# EAGLE design breakout (EAGLE 7.5.0)
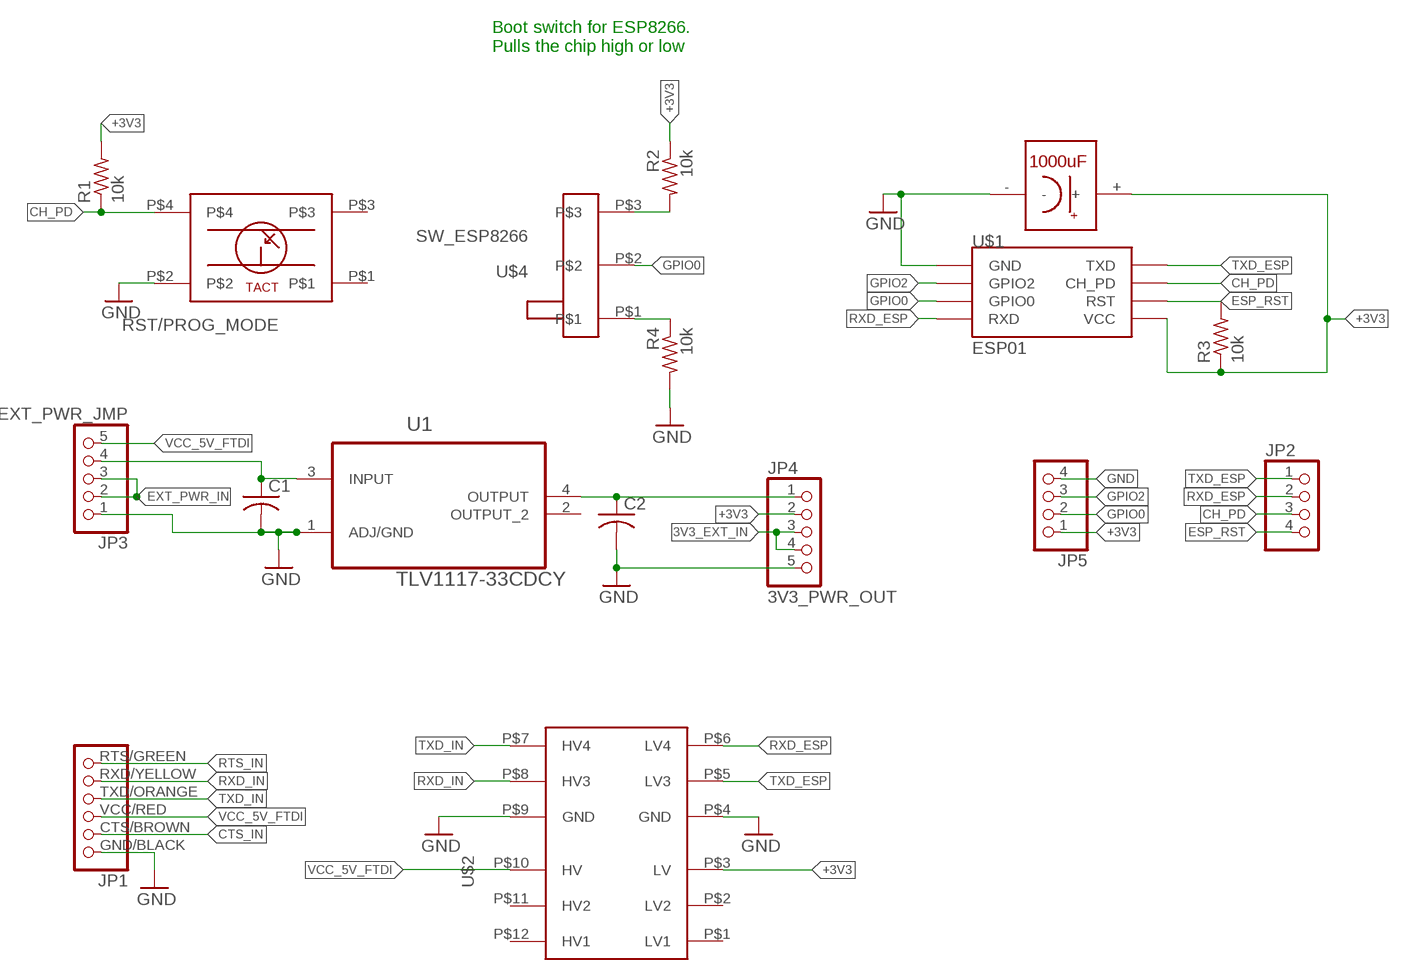
[diagram p0: schematic, sheet 1]

## Parts
C1  C-USC0805K  [C0805K]
C2  C-USC0805K  [C0805K]
JP1  FTDI_CABLE  [FTDI_5V_SPARKFUN]
JP2  PINHD-1X4  [1X04]
JP3  EXT_PWR_JMP  PINHD-1X5  [1X05]
JP4  3V3_PWR_OUT  PINHD-1X5  [1X05]
JP5  PINHD-1X4  [1X04]
R1  10k  R-US_R1206  [R1206]
R2  10k  R-US_R1206  [R1206]
R3  10k  R-US_R1206  [R1206]
R4  10k  R-US_R1206  [R1206]
RST/PROG_MODE  TACT_SWITCH  [TACT]
U1  TLV1117-33CDCY  [SOT230P700X180-4N]
U$1  ESP01  [ESP01]
U$2  LVLSHIFTER  [LVLSFT_PAC]
U$3  TZVCAP  [TZV1000M]
U$4  SW_ESP8266  [SW_PCB_ESP]

## Nets
3V3_EXT_IN: JP4.3 JP4.4
+3V3: JP4.2 JP5.1 R1.2 R2.1 R3.1 U$1.VCC U$2.P$3(LV) U$3.+
CH_PD: JP2.3 R1.1 RST/PROG_MODE.P$4 U$1.CH_PD
CTS_IN: JP1.CTS/BROWN
ESP_RST: JP2.4 R3.2 U$1.RST
EXT_PWR_IN: JP3.2 JP3.3
GND: C1.2 C2.2 JP1.GND/BLACK JP3.1 JP4.5 JP5.4 R4.2 RST/PROG_MODE.P$2 U1.1(ADJ/GND) U$1.GND U$2.P$4(GND) U$2.P$9(GND) U$3.-
GPIO0: JP5.2 U$1.GPIO0 U$4.P$2
GPIO2: JP5.3 U$1.GPIO2
N$1: C2.1 JP4.1 U1.4(OUTPUT)
N$2: C1.1 JP3.4 U1.3(INPUT)
N$4: R2.2 U$4.P$3
N$6: R4.1 U$4.P$1
RTS_IN: JP1.RTS/GREEN
RXD_ESP: JP2.2 U$1.RX(RXD) U$2.P$6(LV4)
RXD_IN: JP1.RXD/YELLOW U$2.P$8(HV3)
TXD_ESP: JP2.1 U$1.TX(TXD) U$2.P$5(LV3)
TXD_IN: JP1.TXD/ORANGE U$2.P$7(HV4)
VCC_5V_FTDI: JP1.VCC/RED JP3.5 U$2.P$10(HV)
Unconnected: RST/PROG_MODE.P$1 RST/PROG_MODE.P$3 U1.2(OUTPUT_2) U$2.P$1(LV1) U$2.P$2(LV2) U$2.P$11(HV2) U$2.P$12(HV1)

## Notes on the sheet
- Boot switch for ESP8266. 
  Pulls the chip high or low

## Library data of the parts
C1 C2 = rcl:C-US: CAPACITOR, American symbol
JP1 = mqp_custom_parts:FTDI_CABLE: PIN HEADER
JP2 JP5 = pinhead:PINHD-1X4: PIN HEADER
JP3 JP4 = pinhead:PINHD-1X5: PIN HEADER
R1-R4 = resistor:R-US_: RESISTOR, American symbol
RST/PROG_MODE = mqp_custom_parts:TACT_SWITCH
U1 = Texas Instruments_By_element14_Batch_1:TLV1117-33CDCY: V REG, LDO, 3.3V, 0.8A; MPN: TLV1117-33CDCY; OC_FARNELL: 1494942; OC_NEWARK: 67K8520; PACKAGE: SOT-223-3; SUPPLIER: TEXAS INSTRUMENTS
U$1 = mqp_custom_parts:ESP01: ESP8266 Wifi module 01
U$2 = mqp_custom_parts:LVLSHIFTER
U$3 = mqp_custom_parts:TZVCAP
U$4 = mqp_custom_parts:SW_ESP8266

## Board
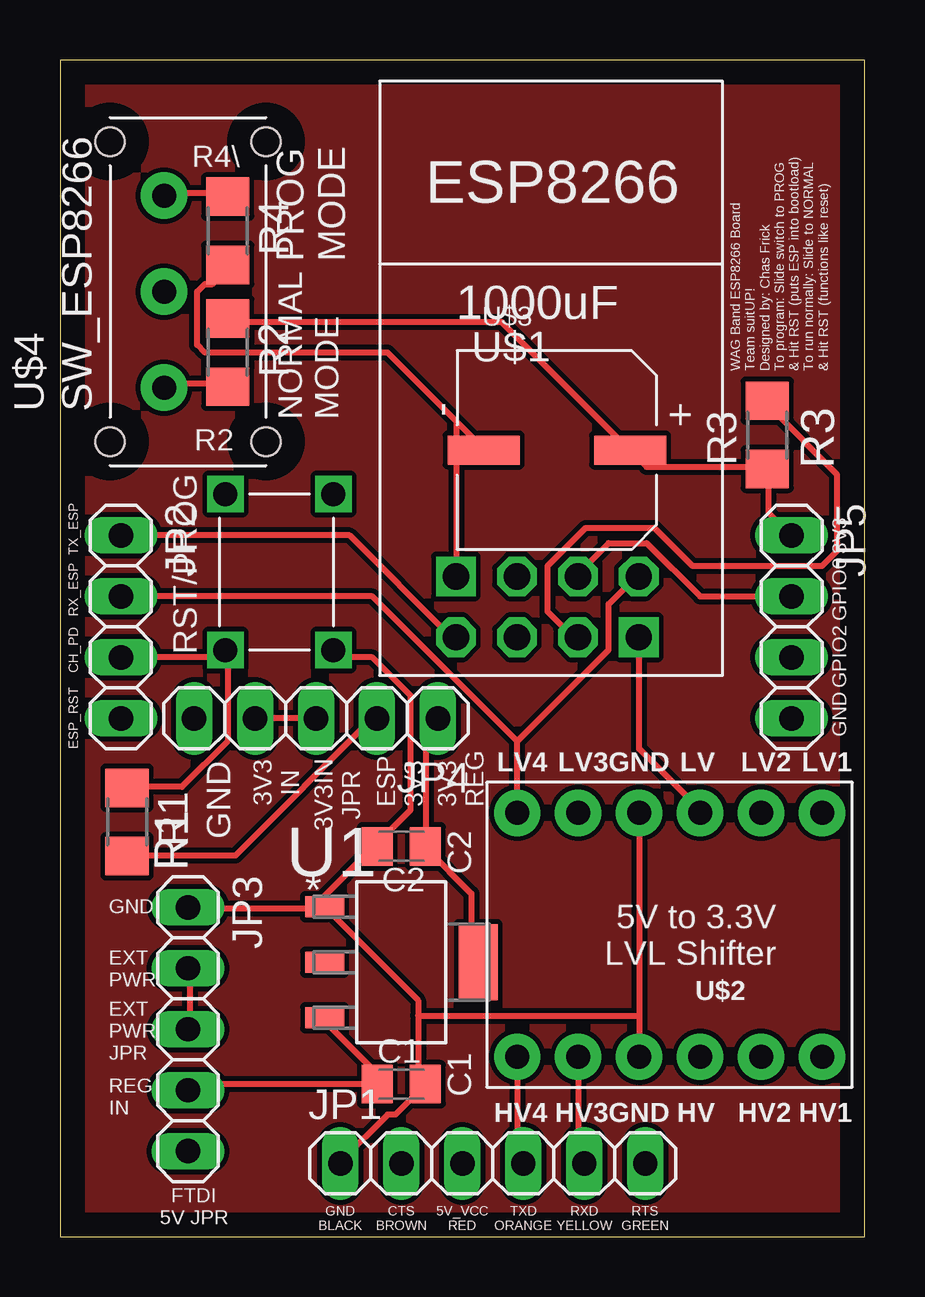
[diagram p1: board, top side]
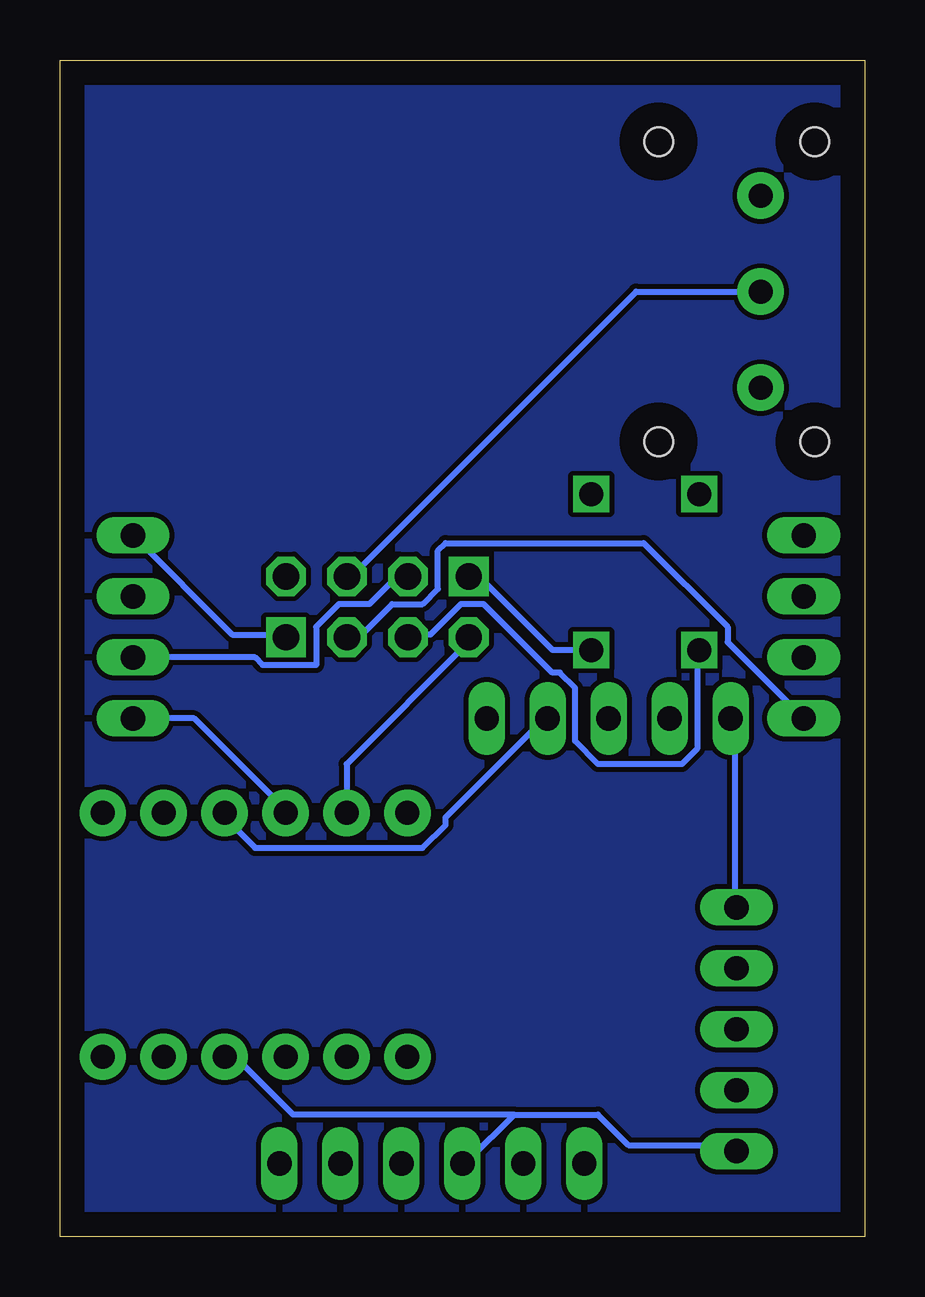
[diagram p2: board, bottom side, seen from below]

Size 33.53 x 49.02 mm. Coordinates in mm from the lower left corner, seen from the top.
Outline: 0,0 33.53,0 33.53,49.02 0,49.02 0,0
Copper layers (1*16): Top 0.035mm / dielectric 1.5mm / Bottom 0.035mm
Design rules "default": minimum track width 10mil, minimum drill 24mil, track to track 8mil, track to pad 8mil, pad to pad 8mil, via to via 8mil, smd to smd 8mil, copper to edge 40mil, drill to drill 8mil, minimum pad ring 10mil, minimum via ring 8mil, stop-mask expansion 4mil, vias tented up to drill 0mil, thermal gap 10mil

### Footprints (pad centres in the part's own frame; a part is rotated, then mirrored left to right if it is on the bottom)
C0805K = smd 1.3 x 1.6: 1 -1,0; 2 1,0
FTDI_5V_SPARKFUN = drill 1.016 long: CTS/BROWN -3.81,0; GND/BLACK -6.35,0; RTS/GREEN 6.35,0; RXD/YELLOW 3.81,0; TXD/ORANGE 1.27,0; VCC/RED -1.27,0
1X04 = drill 1.016 long: 1 -3.81,0; 2 -1.27,0; 3 1.27,0; 4 3.81,0
1X05 = drill 1.016 long: 1 -5.08,0; 2 -2.54,0; 3 0,0; 4 2.54,0; 5 5.08,0
R1206 = smd 1.6 x 1.803: 1 -1.422,0; 2 1.422,0
TACT = drill 1 square: P$1 -3.25,2.25; P$2 3.25,2.25; P$3 -3.25,-2.25; P$4 3.25,-2.25
SOT230P700X180-4N = smd 1.626 x 0.889: 1 -3.2,2.311; 2 -3.2,0; 3 -3.2,-2.311 | smd 1.626 x 3.175: 4 3.2,0
ESP01 = drill 1.1 octagon: CH_PD -1.285,-8.178; GPIO0 1.255,-5.638; GPIO2 -1.285,-5.638; RST 1.255,-8.178; RX 3.795,-5.638; TX -3.825,-8.178 | drill 1.1 square: GND -3.825,-5.638; VCC 3.795,-8.178
LVLSFT_PAC = drill 1 pad 1.93: P$1 -6.35,-5.08; P$2 -3.81,-5.08; P$3 -1.27,-5.08; P$4 1.27,-5.08; P$5 3.81,-5.08; P$6 6.35,-5.08; P$7 6.35,5.08; P$8 3.81,5.08; P$9 1.27,5.08; P$10 -1.27,5.08; P$11 -3.81,5.08; P$12 -6.35,5.08
TZV1000M = smd 1.2 x 3: + 0,3.05; - 0,-3.05
SW_PCB_ESP = drill 1 pad 1.93: P$1 4,1; P$2 0,1; P$3 -4,1 | hole 1.2: -6.25,3.25; -6.25,-3.25; 6.25,-3.25; 6.25,3.25

### Placement (x,y rotation side)
C1  14.22,6.35 0 top
C2  14.22,16.26 180 top
JP1  18.03,3.05 0 top
JP2  2.54,25.4 270 top
JP3  5.33,8.64 270 top
JP4  10.67,21.59 180 top
JP5  30.48,25.4 270 top
R1  2.79,17.27 270 top
R2  6.99,36.83 270 top
R3  29.46,33.4 90 top
R4  6.99,41.91 270 top
RST/PROG_MODE  9.14,27.69 270 top
U1  14.22,11.43 0 top
U$1  20.32,33.15 0 top
U$2  25.4,12.57 180 top
U$3  20.7,32.77 270 top
U$4  5.33,39.37 90 top

### Tracks (layer width: path | path; a pad name or v marks a point on that pad's centre or on a via)
3V3_EXT_IN
  Top 0.254: JP4.3 JP4.4
+3V3
  Top 0.254: R1.2 2.86,15.88 7.3,15.88 13.02,21.59 JP4.2 | U$1.VCC 24.13,24.77 24.13,20.32 26.67,17.78 U$2.P$3 | JP5.1 29.53,30.16 29.53,31.75 R3.1 29.21,32.07 24.45,32.07 23.81,32.7 U$3.+ 23.5,33.02 18.41,38.1 6.99,38.1 R2.1
  Bottom 0.254: JP5.1 26.35,25.08 24.13,25.08 U$1.VCC | JP4.2 13.34,21.59 17.46,17.46 17.46,17.14 18.41,16.19 25.4,16.19 26.67,17.46 U$2.P$3
CH_PD
  Top 0.254: R1.1 2.86,18.73 5.08,18.73 6.99,20.64 6.99,24.13 RST/PROG_MODE.P$4 6.67,24.13 JP2.3
  Bottom 0.254: U$1.CH_PD 18.73,25.08 18.1,25.08 16.83,26.35 15.88,26.35 13.02,23.5 12.7,23.5 12.06,22.86 12.06,20.64 11.11,19.68 7.62,19.68 6.99,20.32 6.99,24.13 RST/PROG_MODE.P$4
ESP_RST
  Top 0.254: R3.2 29.53,34.61 32.38,31.75 32.38,28.57 31.75,27.94 26.35,27.94 24.77,29.53 21.91,29.53 20.32,27.94 20.32,26.04 21.27,25.08 U$1.RST
  Bottom 0.254: JP2.4 5.71,24.77 5.71,25.4 9.21,28.89 17.46,28.89 17.78,28.57 17.78,26.99 18.41,26.35 19.68,26.35 21.27,24.77 U$1.RST
EXT_PWR_IN
  Top 0.254: JP3.3 5.4,8.89 5.4,11.11 JP3.2
GND
  Top 0.254: 16.51,33.97 17.46,33.02 U$3.- | 16.51,33.97 13.65,36.83 6.03,36.83 5.71,37.15 5.71,39.37 6.03,39.69 6.35,39.69 6.99,40.32 R4.2 | 16.51,33.97 16.51,27.62 U$1.GND | U$2.P$4 24.13,9.21 | 24.13,9.21 U$2.P$9 | U1.1 10.79,13.97 13.02,16.19 C2.2 13.34,16.51 14.61,17.78 14.61,22.54 13.02,24.13 11.43,24.13 RST/PROG_MODE.P$2 | 14.92,9.21 14.92,9.84 U1.1 | 14.92,9.21 14.92,6.35 C1.2 15.24,6.35 13.97,5.08 13.65,5.08 11.75,3.17 JP1.GND/BLACK | JP3.1 5.4,13.65 10.79,13.65 U1.1 | 14.92,9.21 24.13,9.21
  Bottom 0.254: RST/PROG_MODE.P$2 11.43,24.45 13.02,24.45 16.19,27.62 U$1.GND | JP5.4 27.94,21.59 24.13,17.78 U$2.P$4 | JP4.5 5.4,21.59 5.4,13.97 JP3.1
GPIO0
  Top 0.254: JP5.2 26.67,26.67 24.45,28.89 22.86,28.89 21.59,27.62 U$1.GPIO0
  Bottom 0.254: U$4.P$2 9.53,39.37 21.27,27.62 U$1.GPIO0
GPIO2
  Bottom 0.254: JP5.3 25.4,24.13 25.08,23.81 22.86,23.81 22.86,25.4 21.91,26.35 20.64,26.35 19.68,27.3 19.05,27.3 U$1.GPIO2
N$1
  Top 0.254: JP4.1 15.56,21.59 15.24,21.27 15.24,16.51 C2.1 15.24,16.19 17.14,14.29 17.14,11.43 U1.4
N$2
  Top 0.254: 13.02,6.35 13.02,6.99 11.11,8.89 U1.3 | 13.02,6.35 5.4,6.35 JP3.4 | 13.02,6.35 C1.1
N$3
  pour Top: 0,48.26 33.02,48.26 33.02,0 0,0
N$4
  Top 0.254: R2.2 6.99,35.56 4.45,35.56 U$4.P$3
N$5
  pour Bottom: 0,48.26 33.02,48.26 33.02,0 0,0
N$6
  Top 0.254: R4.1 6.99,43.5 4.45,43.5 U$4.P$1
RXD_ESP
  Top 0.254: JP2.2 13.02,26.67 19.05,20.64 | U$2.P$6 19.05,20.64 | 19.05,20.64 22.86,24.45 22.86,26.35 23.81,27.3 U$1.RX
RXD_IN
  Top 0.254: U$2.P$8 21.59,3.17 JP1.RXD/YELLOW
TXD_ESP
  Top 0.254: JP2.1 12.06,29.21 16.19,25.08 U$1.TX
  Bottom 0.254: U$2.P$5 21.59,19.68 16.51,24.77 U$1.TX
TXD_IN
  Top 0.254: U$2.P$7 19.05,3.17 JP1.TXD/ORANGE
VCC_5V_FTDI
  Bottom 0.254: 14.61,5.08 11.11,5.08 9.84,3.81 5.4,3.81 JP3.5 | 14.61,5.08 16.51,3.17 JP1.VCC/RED | 14.61,5.08 23.81,5.08 26.04,7.3 26.67,7.3 U$2.P$10

### Text on the board
tPlace: R4\ | PROG / MODE | 1000uF | WAG Band ESP8266 Board / Team suitUP! / Designed by: Chas Frick / To program: Slide switch to PROG / & Hit RST (puts ESP into bootload) / To run normally: Slide to NORMAL / & Hit RST (functions like reset) | R2 | NORMAL / MODE | R3 | TX_ESP | 3V3 | RX_ESP | GPIO0 | RST/PROG | CH_PD | GPIO2 | GND | ESP_RST | GND | 3V3 / IN | 3V3IN / JPR | ESP / 3V3 | 3V3 / REG | R1 | C2 | GND | EXT / PWR | EXT / PWR / JPR | C1 | REG / IN | FTDI / 5V JPR | GND / BLACK | CTS / BROWN | 5V_VCC / RED | TXD / ORANGE | RXD / YELLOW | RTS / GREEN